# EAGLE schematic Panel (EAGLE 7.5.0)

## Sheet 1 of 4: MAIN
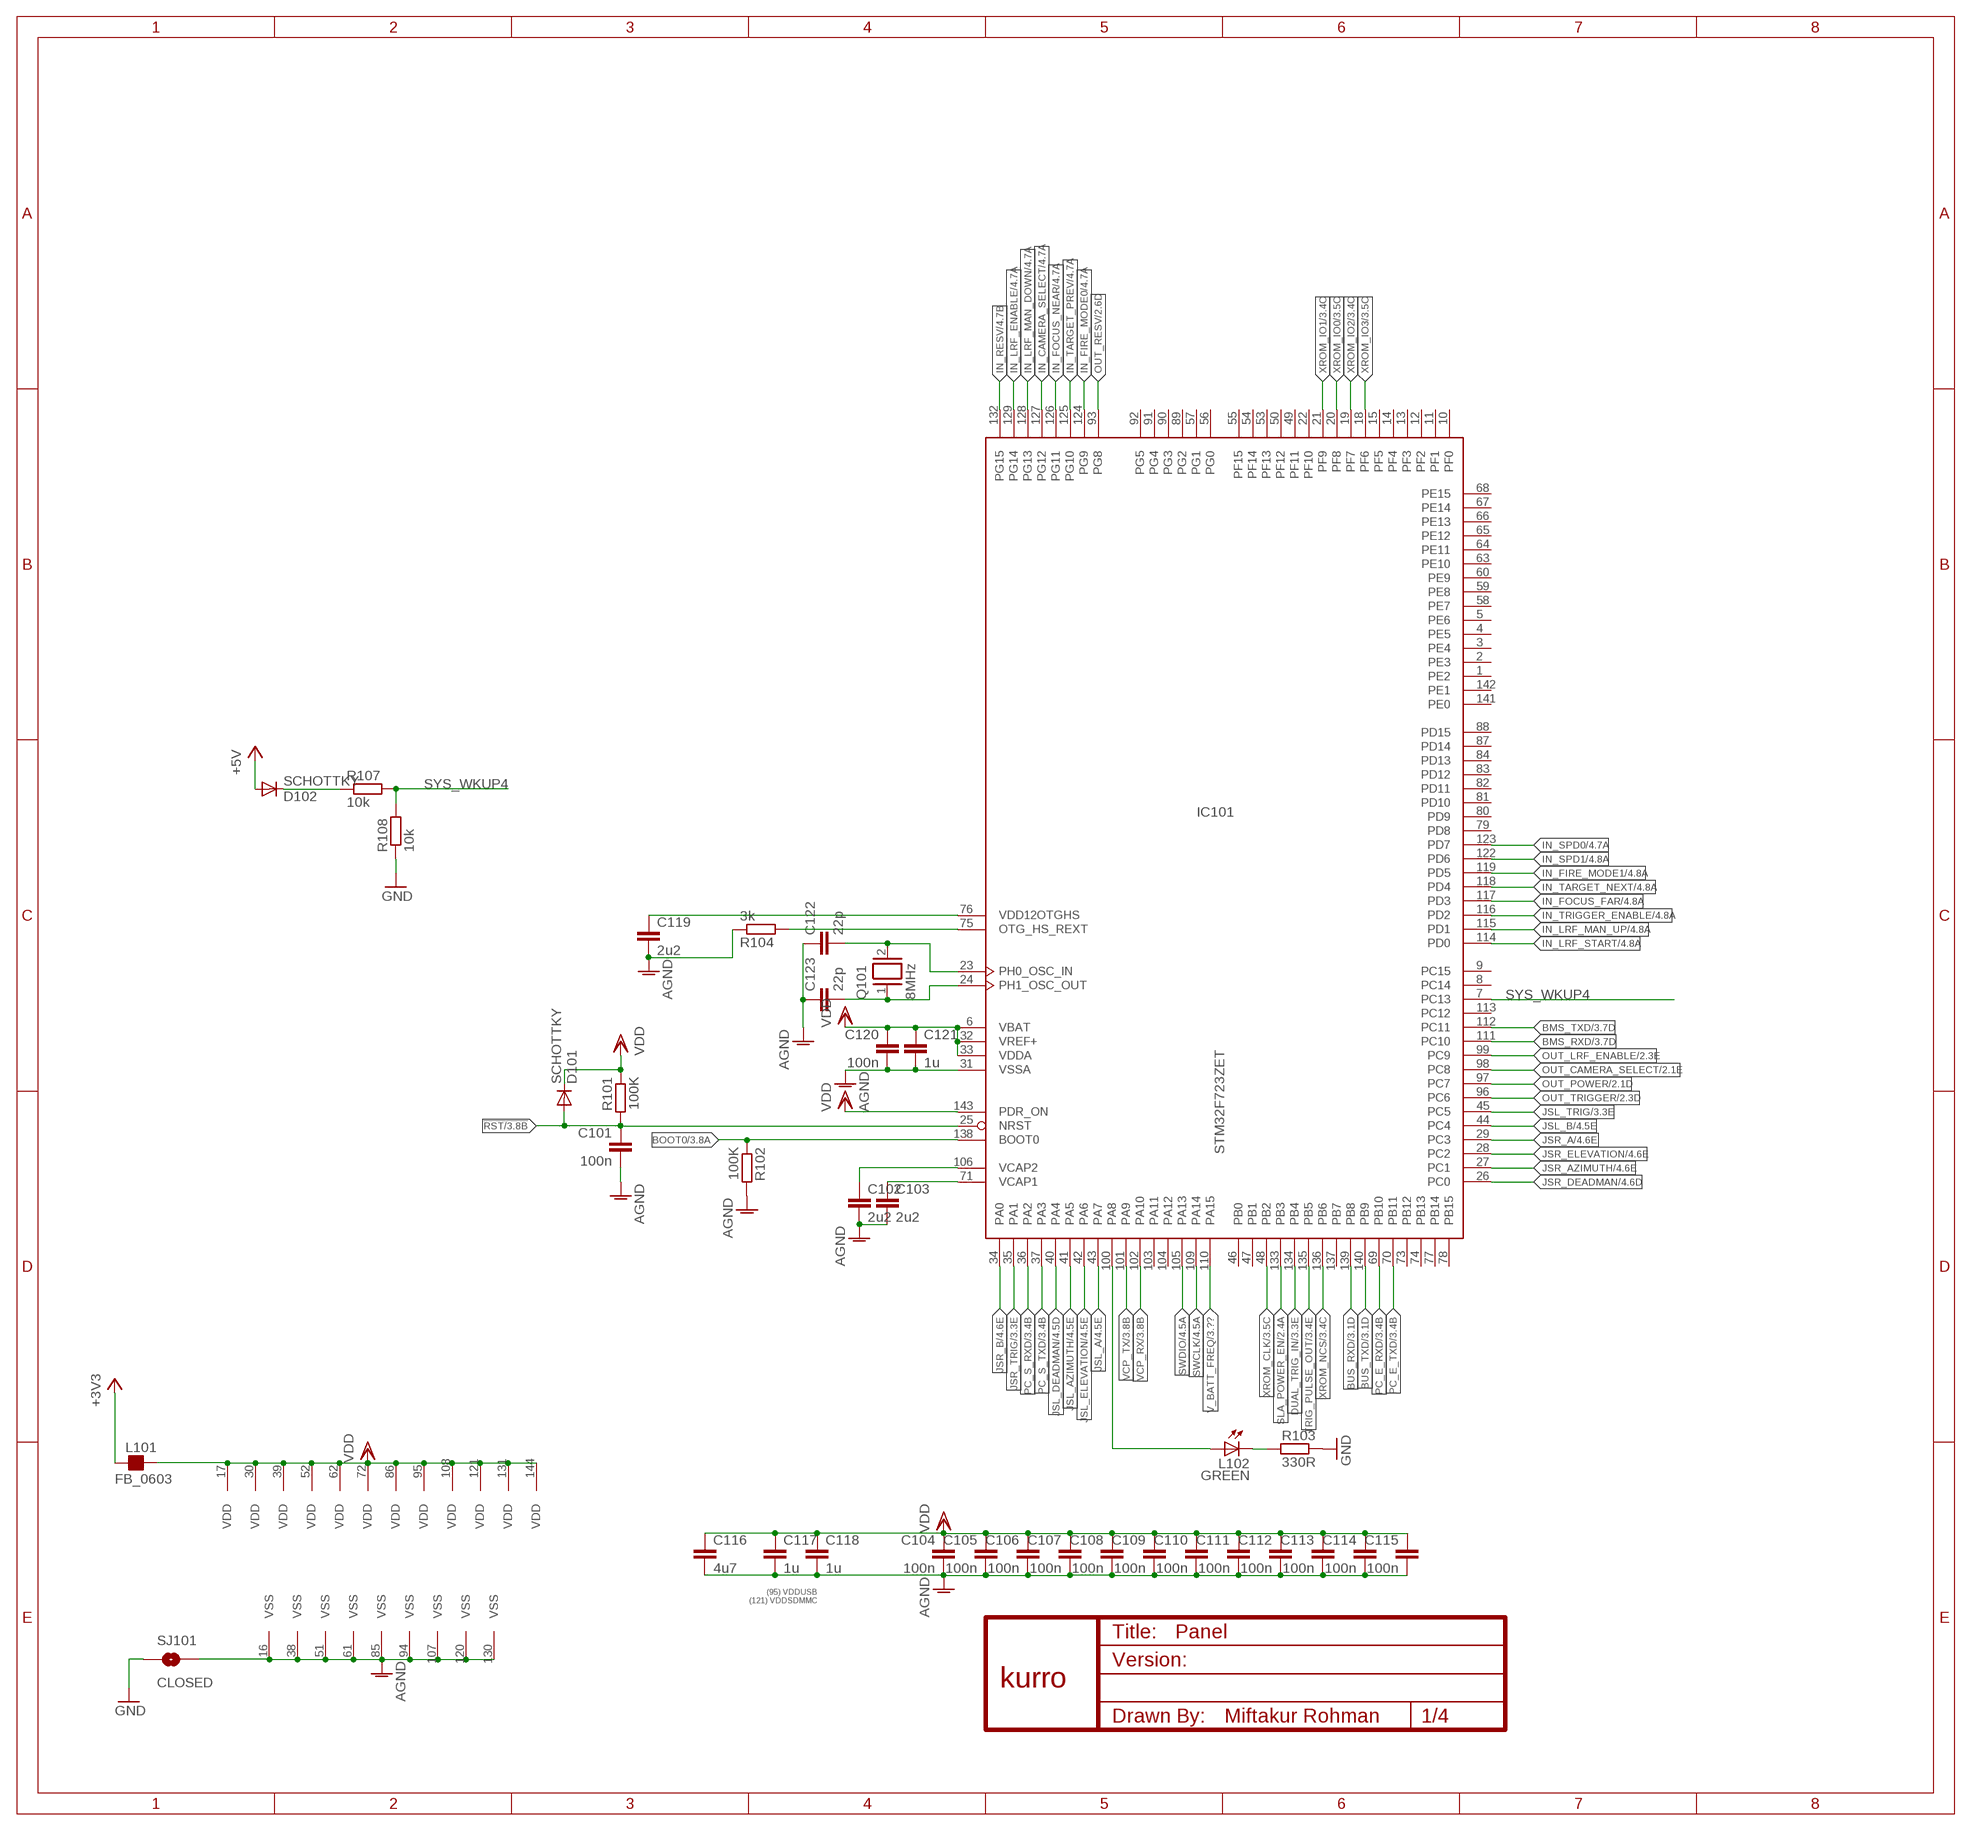
[diagram p0: schematic, sheet 1]

### Parts
C101  100n  C-EUC0603  [C0603]
C102  2u2  C-EUC0805  [C0805]
C103  2u2  C-EUC0805  [C0805]
C104  100n  C-EUC0603  [C0603]
C105  100n  C-EUC0603  [C0603]
C106  100n  C-EUC0603  [C0603]
C107  100n  C-EUC0603  [C0603]
C108  100n  C-EUC0603  [C0603]
C109  100n  C-EUC0603  [C0603]
C110  100n  C-EUC0603  [C0603]
C111  100n  C-EUC0603  [C0603]
C112  100n  C-EUC0603  [C0603]
C113  100n  C-EUC0603  [C0603]
C114  100n  C-EUC0603  [C0603]
C115  100n  C-EUC0603  [C0603]
C116  4u7  C-EUC0805  [C0805]
C117  1u  C-EUC0805  [C0805]
C118  1u  C-EUC0805  [C0805]
C119  2u2  C-EUC0805  [C0805]
C120  100n  C-EUC0603  [C0603]
C121  1u  C-EUC0805  [C0805]
C122  22p  C-EUC0603  [C0603]
C123  22p  C-EUC0603  [C0603]
D101  SCHOTTKY  DIODE-MICROMELF-W  [MICROMELF-W]
D102  SCHOTTKY  DIODE-MICROMELF-W  [MICROMELF-W]
IC101  STM32F723ZET  [LQFP144-2]
L101  FB_0603  [L0603]
L102  GREEN  LEDCHIP-LED0805  [CHIP-LED0805]
Q101  8MHz  XTAL/S  [QS]
R101  100K  R-EU_R0603  [R0603]
R102  100K  R-EU_R0603  [R0603]
R103  330R  R-EU_R0603  [R0603]
R104  3k  R-EU_R0603  [R0603]
R107  10k  R-EU_R0603  [R0603]
R108  10k  R-EU_R0603  [R0603]
SJ101  CLOSED  SOLDERJUMPERTRACE_THICK  [SJ_2S-TRACE_THICK]
U$2  KURRO_FOOTPRINT  [KURRO-LOGO]

### Nets
!RST [ic]: C101.1 D101.A IC101.25(NRST) R101.2 ; also sheet 3
+3V3: L101.1 ; also sheet 2,3,4
+5V: D102.A ; also sheet 2,3
AGND [ic]: C101.2 C102.2 C103.2 C104.2 C105.2 C106.2 C107.2 C108.2 C109.2 C110.2 C111.2 C112.2 C113.2 C114.2 C115.2 C116.2 C117.2 C118.2 C119.2 C120.2 C121.2 C122.1 C123.1 IC101.16(VSS) IC101.31(VSSA) IC101.38(VSS) IC101.51(VSS) IC101.61(VSS) IC101.85(VSS) IC101.94(VSS) IC101.107(VSS) IC101.120(VSS) IC101.130(VSS) R102.2 R104.1 SJ101.2
BMS_RXD: IC101.111(PC10) ; also sheet 3
BMS_TXD: IC101.112(PC11) ; also sheet 3
BOOT0 [ic]: IC101.138(BOOT0) R102.1 ; also sheet 3
BUS_RXD: IC101.139(PB8) ; also sheet 3
BUS_TXD: IC101.140(PB9) ; also sheet 3
DUAL_TRIG_IN: IC101.134(PB4) ; also sheet 3
GND: R103.1 R108.1 SJ101.1 ; also sheet 2,3,4
IN_CAMERA_SELECT: IC101.127(PG12) ; also sheet 4
IN_FIRE_MODE0: IC101.124(PG9) ; also sheet 4
IN_FIRE_MODE1: IC101.119(PD5) ; also sheet 4
IN_FOCUS_FAR: IC101.117(PD3) ; also sheet 4
IN_FOCUS_NEAR: IC101.126(PG11) ; also sheet 4
IN_LRF_ENABLE: IC101.129(PG14) ; also sheet 4
IN_LRF_MAN_DOWN: IC101.128(PG13) ; also sheet 4
IN_LRF_MAN_UP: IC101.115(PD1) ; also sheet 4
IN_LRF_START: IC101.114(PD0) ; also sheet 4
IN_RESV: IC101.132(PG15) ; also sheet 4
IN_SPD0: IC101.123(PD7) ; also sheet 4
IN_SPD1: IC101.122(PD6) ; also sheet 4
IN_TARGET_NEXT: IC101.118(PD4) ; also sheet 4
IN_TARGET_PREV: IC101.125(PG10) ; also sheet 4
IN_TRIGGER_ENABLE: IC101.116(PD2) ; also sheet 4
JSL_A [ic]: IC101.43(PA7) ; also sheet 4
JSL_AZIMUTH [ic]: IC101.41(PA5) ; also sheet 4
JSL_B [ic]: IC101.44(PC4) ; also sheet 4
JSL_DEADMAN [ic]: IC101.40(PA4) ; also sheet 4
JSL_ELEVATION [ic]: IC101.42(PA6) ; also sheet 4
JSL_TRIG [ic]: IC101.45(PC5) ; also sheet 3,4
JSR_A [ic]: IC101.29(PC3) ; also sheet 4
JSR_AZIMUTH [ic]: IC101.27(PC1) ; also sheet 4
JSR_B [ic]: IC101.34(PA0) ; also sheet 4
JSR_DEADMAN [ic]: IC101.26(PC0) ; also sheet 4
JSR_ELEVATION [ic]: IC101.28(PC2) ; also sheet 4
JSR_TRIG [ic]: IC101.35(PA1) ; also sheet 3,4
N$1: IC101.75(OTG_HS_REXT) R104.2
N$9: L102.C R103.2
N$12: IC101.100(PA8) L102.A
N$13: C119.1 IC101.76(VDD12OTGHS)
N$14 [ic]: C123.2 IC101.24(PH1_OSC_OUT) Q101.1
N$16 [ic]: C122.2 IC101.23(PH0_OSC_IN) Q101.2
N$34: D102.C R107.1
OUT_CAMERA_SELECT: IC101.98(PC8) ; also sheet 2
OUT_LRF_ENABLE: IC101.99(PC9) ; also sheet 2
OUT_POWER: IC101.97(PC7) ; also sheet 2
OUT_RESV: IC101.93(PG8) ; also sheet 2
OUT_TRIGGER: IC101.96(PC6) ; also sheet 2
PC_E_RXD [ic]: IC101.69(PB10) ; also sheet 3
PC_E_TXD [ic]: IC101.70(PB11) ; also sheet 3
PC_S_RXD: IC101.36(PA2) ; also sheet 3
PC_S_TXD: IC101.37(PA3) ; also sheet 3
SLA_POWER_EN [ic]: IC101.133(PB3) ; also sheet 2
SWCLK [ic]: IC101.109(PA14) ; also sheet 4
SWDIO [ic]: IC101.105(PA13) ; also sheet 4
SYS_WKUP4: IC101.7(PC13) R107.2 R108.2
TRIG_PULSE_OUT [ic]: IC101.135(PB5) ; also sheet 3
V_BATT_FREQ: IC101.110(PA15) ; also sheet 3
VCAP1: C103.1 IC101.71(VCAP1)
VCAP2: C102.1 IC101.106(VCAP2)
VCP_RX [ic]: IC101.102(PA10) ; also sheet 3,4
VCP_TX [ic]: IC101.101(PA9) ; also sheet 3,4
VDD [ic]: C104.1 C105.1 C106.1 C107.1 C108.1 C109.1 C110.1 C111.1 C112.1 C113.1 C114.1 C115.1 C116.1 C117.1 C118.1 C120.1 C121.1 D101.C IC101.6(VBAT) IC101.17(VDD) IC101.30(VDD) IC101.32(VREF+) IC101.33(VDDA) IC101.39(VDD) IC101.52(VDD) IC101.62(VDD) IC101.72(VDD) IC101.86(VDD) IC101.95(VDD) IC101.108(VDD) IC101.121(VDD) IC101.131(VDD) IC101.143(PDR_ON) IC101.144(VDD) L101.2 R101.1 ; also sheet 2,3,4
XROM_CLK [ic]: IC101.48(PB2) ; also sheet 3
XROM_IO0 [ic]: IC101.20(PF8) ; also sheet 3
XROM_IO1 [ic]: IC101.21(PF9) ; also sheet 3
XROM_IO2 [ic]: IC101.19(PF7) ; also sheet 3
XROM_IO3 [ic]: IC101.18(PF6) ; also sheet 3
XROM_NCS [ic]: IC101.136(PB6) ; also sheet 3
Unconnected: IC101.1(PE2) IC101.2(PE3) IC101.3(PE4) IC101.4(PE5) IC101.5(PE6) IC101.8(PC14) IC101.9(PC15) IC101.10(PF0) IC101.11(PF1) IC101.12(PF2) IC101.13(PF3) IC101.14(PF4) IC101.15(PF5) IC101.22(PF10) IC101.46(PB0) IC101.47(PB1) IC101.49(PF11) IC101.50(PF12) IC101.53(PF13) IC101.54(PF14) IC101.55(PF15) IC101.56(PG0) IC101.57(PG1) IC101.58(PE7) IC101.59(PE8) IC101.60(PE9) IC101.63(PE10) IC101.64(PE11) IC101.65(PE12) IC101.66(PE13) IC101.67(PE14) IC101.68(PE15) IC101.73(PB12) IC101.74(PB13) IC101.77(PB14) IC101.78(PB15) IC101.79(PD8) IC101.80(PD9) IC101.81(PD10) IC101.82(PD11) IC101.83(PD12) IC101.84(PD13) IC101.87(PD14) IC101.88(PD15) IC101.89(PG2) IC101.90(PG3) IC101.91(PG4) IC101.92(PG5) IC101.103(PA11) IC101.104(PA12) IC101.113(PC12) IC101.137(PB7) IC101.141(PE0) IC101.142(PE1)

### Notes on the sheet
- (95) VDDUSB
  (121) VDDSDMMC

## Sheet 2 of 4: PSU
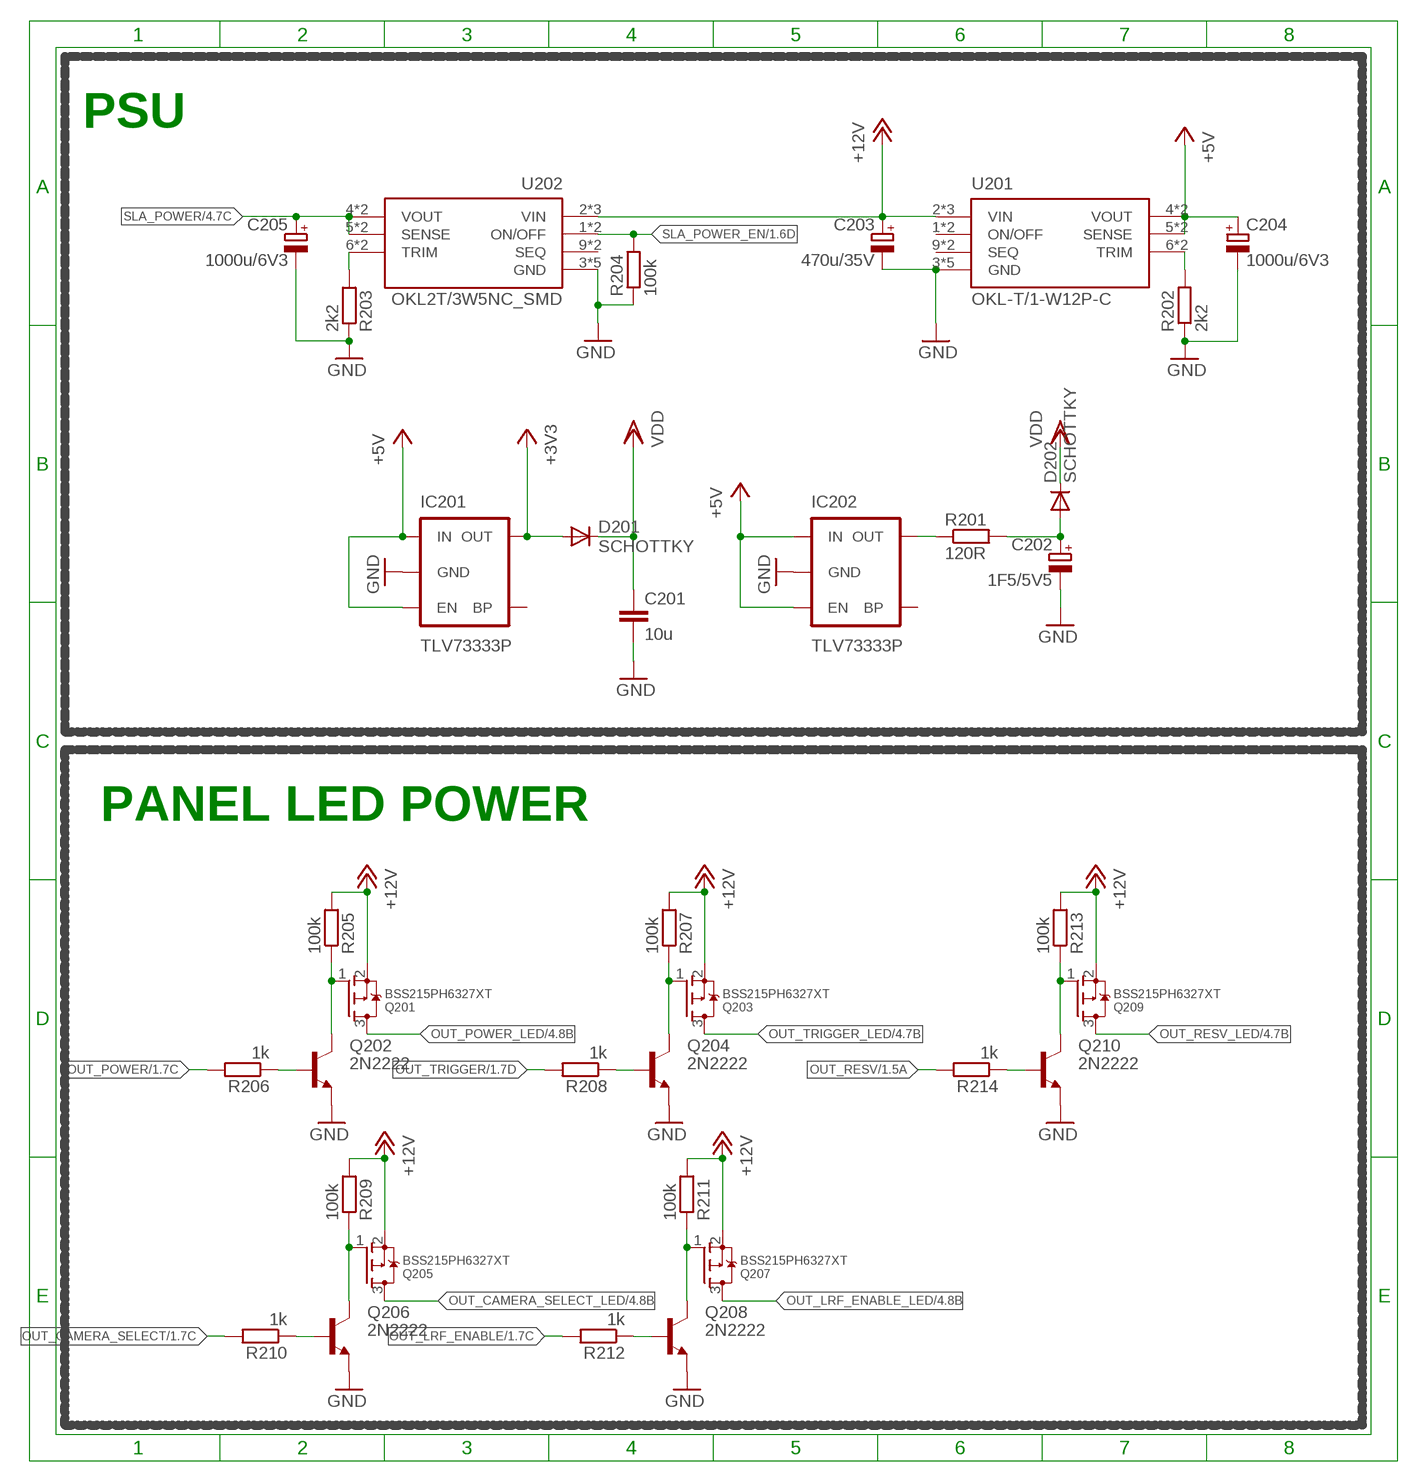
[diagram p1: schematic, sheet 2]

### Parts
C201  10u  C-EUC0805  [C0805]
C202  1F5/5V5  SUPER_CAP_1F/5V5  [SC_1F/5V5]
C203  470u/35V  CPOL-EU153CLV-1012  [153CLV-1012]
C204  1000u/6V3  CPOL-EU153CLV-0810  [153CLV-0810]
C205  1000u/6V3  CPOL-EU153CLV-0810  [153CLV-0810]
D201  SCHOTTKY  DIODE-MICROMELF-W  [MICROMELF-W]
D202  SCHOTTKY  DIODE-MICROMELF-W  [MICROMELF-W]
IC201  TLV73333P  V_REG_LDOSMD  [SOT23-5]
IC202  TLV73333P  V_REG_LDOSMD  [SOT23-5]
Q201  BSS215PH6327XT  A03401-WIDE  [SOT23-W]
Q202  2N2222  2N2222-REFLOW  [SOT23]
Q203  BSS215PH6327XT  A03401-WIDE  [SOT23-W]
Q204  2N2222  2N2222-REFLOW  [SOT23]
Q205  BSS215PH6327XT  A03401-WIDE  [SOT23-W]
Q206  2N2222  2N2222-REFLOW  [SOT23]
Q207  BSS215PH6327XT  A03401-WIDE  [SOT23-W]
Q208  2N2222  2N2222-REFLOW  [SOT23]
Q209  BSS215PH6327XT  A03401-WIDE  [SOT23-W]
Q210  2N2222  2N2222-REFLOW  [SOT23]
R201  120R  R-EU_R0603  [R0603]
R202  2k2  R-EU_R0603  [R0603]
R203  2k2  R-EU_R0603  [R0603]
R204  100k  R-EU_R0603  [R0603]
R205  100k  R-EU_R0603  [R0603]
R206  1k  R-EU_R0603  [R0603]
R207  100k  R-EU_R0603  [R0603]
R208  1k  R-EU_R0603  [R0603]
R209  100k  R-EU_R0603  [R0603]
R210  1k  R-EU_R0603  [R0603]
R211  100k  R-EU_R0603  [R0603]
R212  1k  R-EU_R0603  [R0603]
R213  100k  R-EU_R0603  [R0603]
R214  1k  R-EU_R0603  [R0603]
U201  OKL-T/1-W12P-C  OKL2T/3W5NC_SMD  [OKL2T/3W5NC]
U202  OKL2T/3W5NC_SMD  [OKL2T/3W5NC]

### Nets
+3V3: D201.A IC201.5(OUT) ; also sheet 1,3,4
+5V: C204.+ IC201.1(IN) IC201.3(EN) IC202.1(IN) IC202.3(EN) U201.4(VOUT) U201.4@1(VOUT) U201.5(SENSE) U201.5@1(SENSE) ; also sheet 1,3
+12V [power]: C203.+ Q201.2(S) Q203.2(S) Q205.2(S) Q207.2(S) Q209.2(S) R205.2 R207.2 R209.2 R211.2 R213.2 U201.2(VIN) U201.2@1(VIN) U201.2@2(VIN) U202.2(VIN) U202.2@1(VIN) U202.2@2(VIN) ; also sheet 3,4
GND: C201.2 C202.2(-) C203.- C204.- C205.- IC201.2(GND) IC202.2(GND) Q202.2(E) Q204.2(E) Q206.2(E) Q208.2(E) Q210.2(E) R202.1 R203.1 R204.1 U201.3(GND) U201.3@1(GND) U201.3@2(GND) U201.7(GND) U201.7@1(GND) U202.3(GND) U202.3@1(GND) U202.3@2(GND) U202.7(GND) U202.7@1(GND) ; also sheet 1,3,4
N$6: R202.2 U201.6(TRIM) U201.6@1(TRIM)
N$7: IC202.5(OUT) R201.1
N$17: Q209.1(G) Q210.3(C) R213.1
N$18: Q201.1(G) Q202.3(C) R205.1
N$20: Q202.1(B) R206.1
N$21: Q203.1(G) Q204.3(C) R207.1
N$32: Q204.1(B) R208.1
N$33: Q210.1(B) R214.1
N$48: Q205.1(G) Q206.3(C) R209.1
N$49: Q206.1(B) R210.1
N$51: Q207.1(G) Q208.3(C) R211.1
N$52: Q208.1(B) R212.1
N$53: R203.2 U202.6(TRIM) U202.6@1(TRIM)
OUT_CAMERA_SELECT: R210.2 ; also sheet 1
OUT_CAMERA_SELECT_LED: Q205.3(D) ; also sheet 4
OUT_LRF_ENABLE: R212.2 ; also sheet 1
OUT_LRF_ENABLE_LED: Q207.3(D) ; also sheet 4
OUT_POWER: R206.2 ; also sheet 1
OUT_POWER_LED: Q201.3(D) ; also sheet 4
OUT_RESV: R214.2 ; also sheet 1
OUT_RESV_LED: Q209.3(D) ; also sheet 4
OUT_TRIGGER: R208.2 ; also sheet 1
OUT_TRIGGER_LED: Q203.3(D) ; also sheet 4
SLA_POWER: C205.+ U202.4(VOUT) U202.4@1(VOUT) U202.5(SENSE) U202.5@1(SENSE) ; also sheet 4
SLA_POWER_EN [ic]: R204.2 U202.1(ON/OFF) U202.1@1(ON/OFF) ; also sheet 1
V_SCAP1: C202.1(+) D202.A R201.2
VDD [ic]: C201.1 D201.C D202.C ; also sheet 1,3,4
Unconnected: IC201.4(BP) IC202.4(BP) U201.1(ON/OFF) U201.1@1(ON/OFF) U201.9(SEQ) U201.9@1(SEQ) U202.9(SEQ) U202.9@1(SEQ)

### Notes on the sheet
- PSU
- PANEL LED POWER

## Sheet 3 of 4: I/F
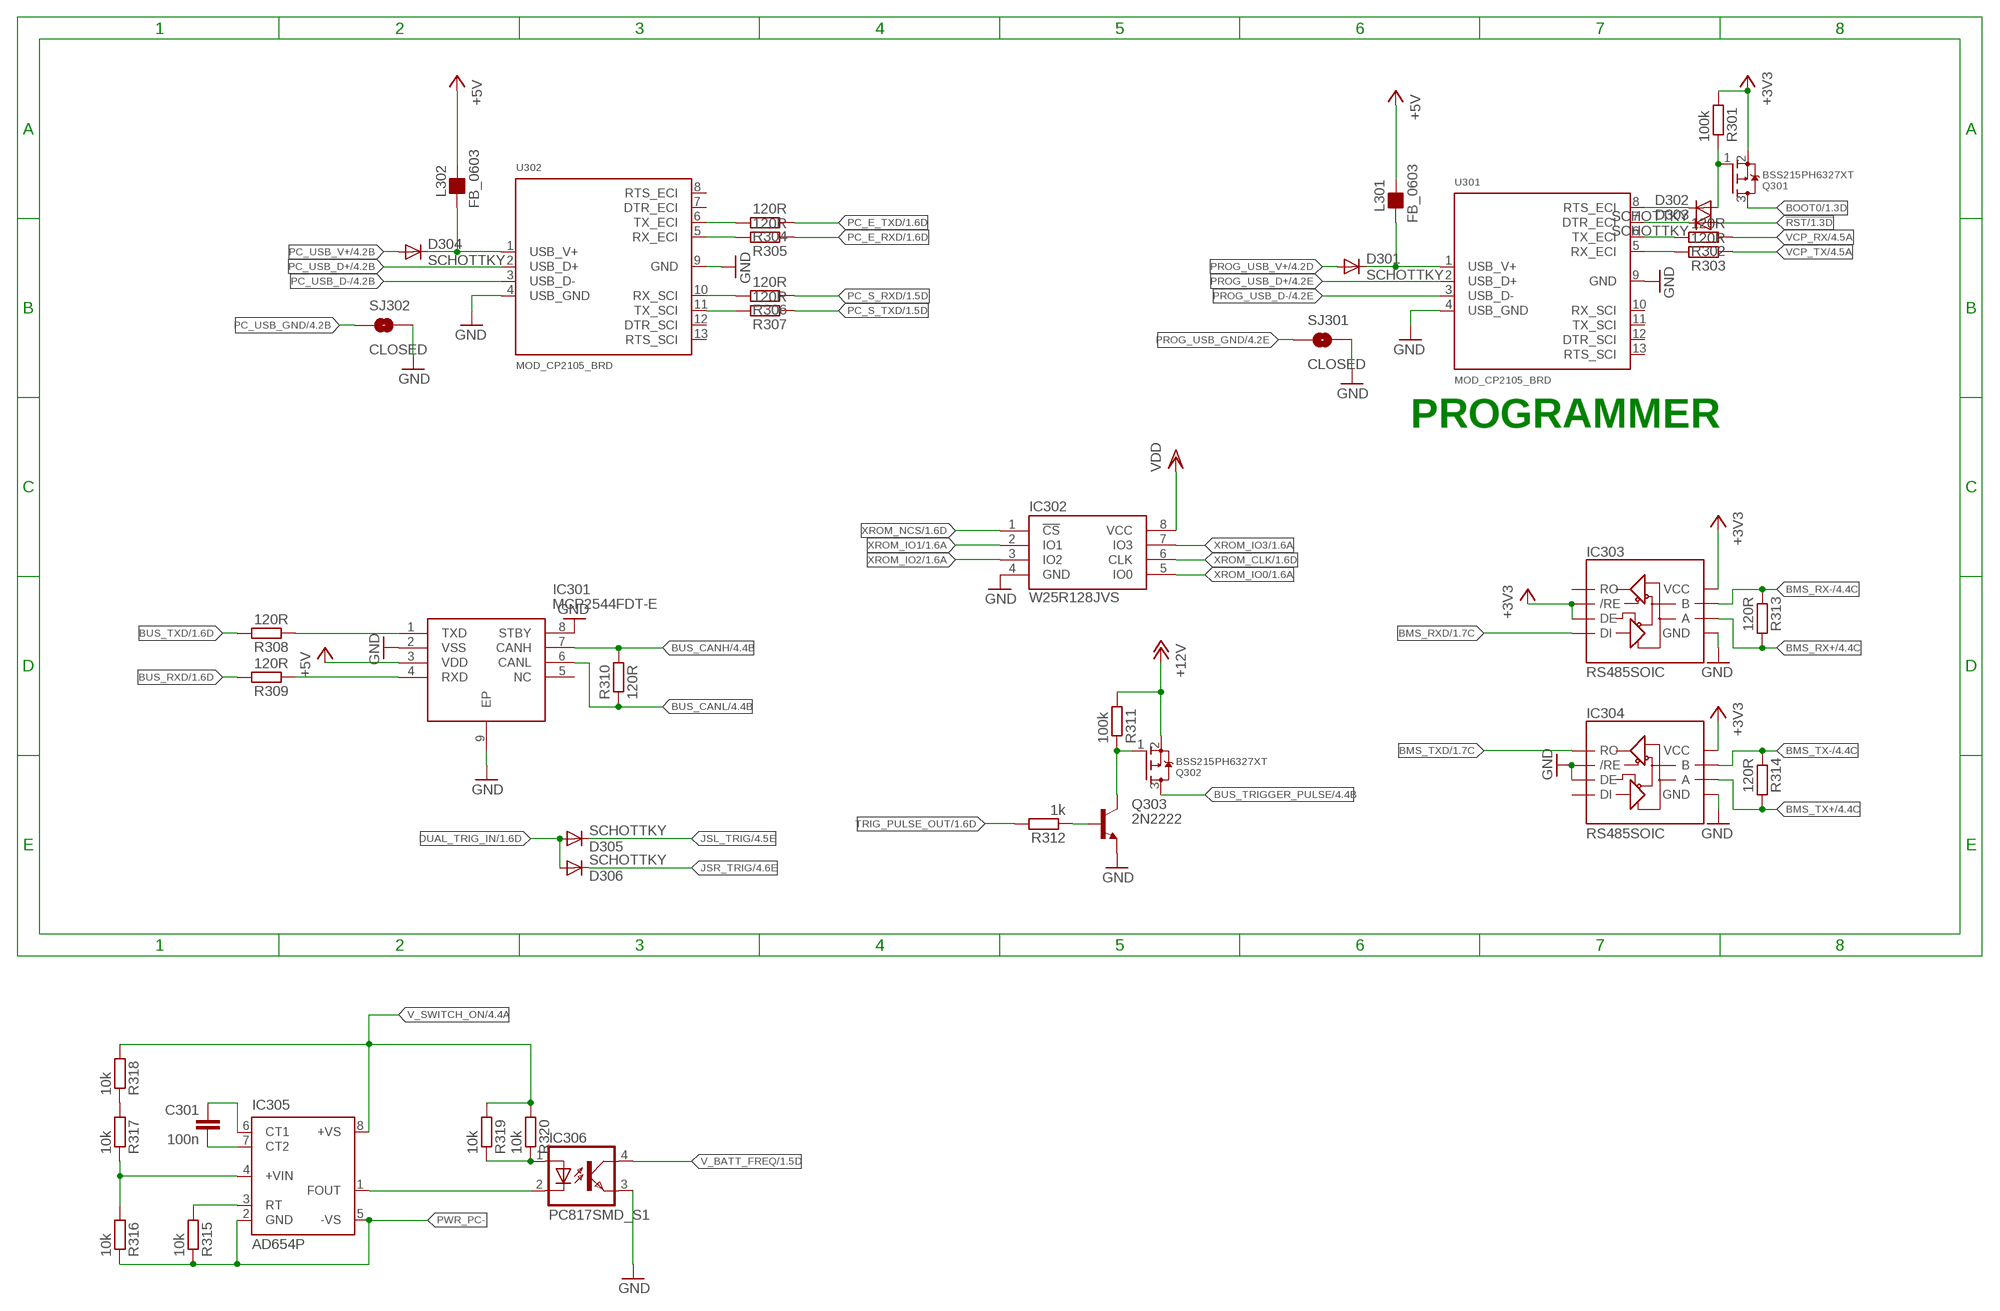
[diagram p2: schematic, sheet 3]

### Parts
C301  100n  C-EUC0603  [C0603]
D301  SCHOTTKY  DIODE-MICROMELF-W  [MICROMELF-W]
D302  SCHOTTKY  DIODE-MICROMELF-W  [MICROMELF-W]
D303  SCHOTTKY  DIODE-MICROMELF-W  [MICROMELF-W]
D304  SCHOTTKY  DIODE-MICROMELF-W  [MICROMELF-W]
D305  SCHOTTKY  DIODE-MICROMELF-W  [MICROMELF-W]
D306  SCHOTTKY  DIODE-MICROMELF-W  [MICROMELF-W]
IC301  MCP2544FDT-E  [TDFN-8]
IC302  W25R128JVS  [SO08]
IC303  RS485SOIC  [SO08]
IC304  RS485SOIC  [SO08]
IC305  AD654P  [DIL08]
IC306  PC817SMD_S1  [PC817SMD]
L301  FB_0603  [L0603]
L302  FB_0603  [L0603]
Q301  BSS215PH6327XT  A03401-WIDE  [SOT23-W]
Q302  BSS215PH6327XT  A03401-WIDE  [SOT23-W]
Q303  2N2222  2N2222-REFLOW  [SOT23]
R301  100k  R-EU_R0603  [R0603]
R302  120R  R-EU_R0603  [R0603]
R303  120R  R-EU_R0603  [R0603]
R304  120R  R-EU_R0603  [R0603]
R305  120R  R-EU_R0603  [R0603]
R306  120R  R-EU_R0603  [R0603]
R307  120R  R-EU_R0603  [R0603]
R308  120R  R-EU_R0603  [R0603]
R309  120R  R-EU_R0603  [R0603]
R310  120R  R-EU_R0603  [R0603]
R311  100k  R-EU_R0603  [R0603]
R312  1k  R-EU_R0603  [R0603]
R313  120R  R-EU_R0603  [R0603]
R314  120R  R-EU_R0603  [R0603]
R315  10k  R-EU_R0603  [R0603]
R316  10k  R-EU_R0603  [R0603]
R317  10k  R-EU_R0603  [R0603]
R318  10k  R-EU_R0603  [R0603]
R319  10k  R-EU_R0603  [R0603]
R320  10k  R-EU_R0603  [R0603]
SJ301  CLOSED  SOLDERJUMPERTRACE_THICK  [SJ_2S-TRACE_THICK]
SJ302  CLOSED  SOLDERJUMPERTRACE_THICK  [SJ_2S-TRACE_THICK]
U301  MOD_CP2105_BRD  [MOD_CP2105_BOARD]
U302  MOD_CP2105_BRD  [MOD_CP2105_BOARD]

### Nets
!RST [ic]: D303.A ; also sheet 1
+3V3: IC303.2(/RE) IC303.3(DE) IC303.8(VCC) IC304.8(VCC) Q301.2(S) R301.2 ; also sheet 1,2,4
+5V: IC301.3(VDD) L301.2 L302.2 ; also sheet 1,2
+12V [power]: Q302.2(S) R311.2 ; also sheet 2,4
BMS_RX+: IC303.6(A) R313.2 ; also sheet 4
BMS_RX-: IC303.7(B) R313.1 ; also sheet 4
BMS_RXD: IC303.4(DI) ; also sheet 1
BMS_TX+: IC304.6(A) R314.2 ; also sheet 4
BMS_TX-: IC304.7(B) R314.1 ; also sheet 4
BMS_TXD: IC304.1(RO) ; also sheet 1
BOOT0 [ic]: Q301.3(D) ; also sheet 1
BUS_CANH: IC301.7(CANH) R310.2 ; also sheet 4
BUS_CANL: IC301.6(CANL) R310.1 ; also sheet 4
BUS_RXD: R309.2 ; also sheet 1
BUS_TRIGGER_PULSE: Q302.3(D) ; also sheet 4
BUS_TXD: R308.2 ; also sheet 1
DUAL_TRIG_IN: D305.A D306.A ; also sheet 1
GND: IC301.2(VSS) IC301.8(STBY) IC301.9(EP) IC302.4(GND) IC303.5(GND) IC304.2(/RE) IC304.3(DE) IC304.5(GND) IC306.3(EMIT) Q303.2(E) SJ301.2 SJ302.2 U301.4(USB_GND) U301.9(GND) U302.4(USB_GND) U302.9(GND) ; also sheet 1,2,4
JSL_TRIG [ic]: D305.C ; also sheet 1,4
JSR_TRIG [ic]: D306.C ; also sheet 1,4
N$2: Q302.1(G) Q303.3(C) R311.1
N$3: Q303.1(B) R312.1
N$4: IC301.1(TXD) R308.1
N$5: IC301.4(RXD) R309.1
N$8: R303.2 U301.5(RX_ECI)
N$15: IC305.1(FOUT) IC306.2(C)
N$19: R302.2 U301.6(TX_ECI)
N$22: D303.C U301.7(DTR_ECI)
N$23: D302.C U301.8(RTS_ECI)
N$24: D301.C L301.1 U301.1(USB_V+)
N$25: D302.A Q301.1(G) R301.1
N$26: R305.2 U302.5(RX_ECI)
N$27: R304.2 U302.6(TX_ECI)
N$28: R306.2 U302.10(RX_SCI)
N$29: R307.2 U302.11(TX_SCI)
N$30: IC306.1(A) R319.1 R320.1
N$31: D304.C L302.1 U302.1(USB_V+)
N$35: IC305.3(RT) R315.2
N$37: C301.2 IC305.7(CT2)
N$38: C301.1 IC305.6(CT1)
N$39: IC305.4(+VIN) R316.2 R317.1
N$41: R317.2 R318.1
PC_E_RXD [ic]: R305.1 ; also sheet 1
PC_E_TXD [ic]: R304.1 ; also sheet 1
PC_S_RXD: R306.1 ; also sheet 1
PC_S_TXD: R307.1 ; also sheet 1
PC_USB_D+: U302.2(USB_D+) ; also sheet 4
PC_USB_D-: U302.3(USB_D-) ; also sheet 4
PC_USB_GND: SJ302.1 ; also sheet 4
PC_USB_V+: D304.A ; also sheet 4
PROG_USB_D+: U301.2(USB_D+) ; also sheet 4
PROG_USB_D-: U301.3(USB_D-) ; also sheet 4
PROG_USB_GND: SJ301.1 ; also sheet 4
PROG_USB_V+: D301.A ; also sheet 4
PWR_PC- [power]: IC305.2(GND) IC305.5(-VS) R315.1 R316.1 ; also sheet 4
TRIG_PULSE_OUT [ic]: R312.2 ; also sheet 1
V_BATT_FREQ: IC306.4(COL) ; also sheet 1
V_SWITCH_ON [power]: IC305.8(+VS) R318.2 R319.2 R320.2 ; also sheet 4
VCP_RX [ic]: R302.1 ; also sheet 1,4
VCP_TX [ic]: R303.1 ; also sheet 1,4
VDD [ic]: IC302.8(VCC) ; also sheet 1,2,4
XROM_CLK [ic]: IC302.6(CLK) ; also sheet 1
XROM_IO0 [ic]: IC302.5(IO0) ; also sheet 1
XROM_IO1 [ic]: IC302.2(IO1) ; also sheet 1
XROM_IO2 [ic]: IC302.3(IO2) ; also sheet 1
XROM_IO3 [ic]: IC302.7(IO3) ; also sheet 1
XROM_NCS [ic]: IC302.1(!CS) ; also sheet 1
Unconnected: IC301.5(NC) IC303.1(RO) IC304.4(DI) U301.10(RX_SCI) U301.11(TX_SCI) U301.12(DTR_SCI) U301.13(RTS_SCI) U302.7(DTR_ECI) U302.8(RTS_ECI) U302.12(DTR_SCI) U302.13(RTS_SCI)

### Notes on the sheet
- PROGRAMMER

## Sheet 4 of 4: CONNECTOR
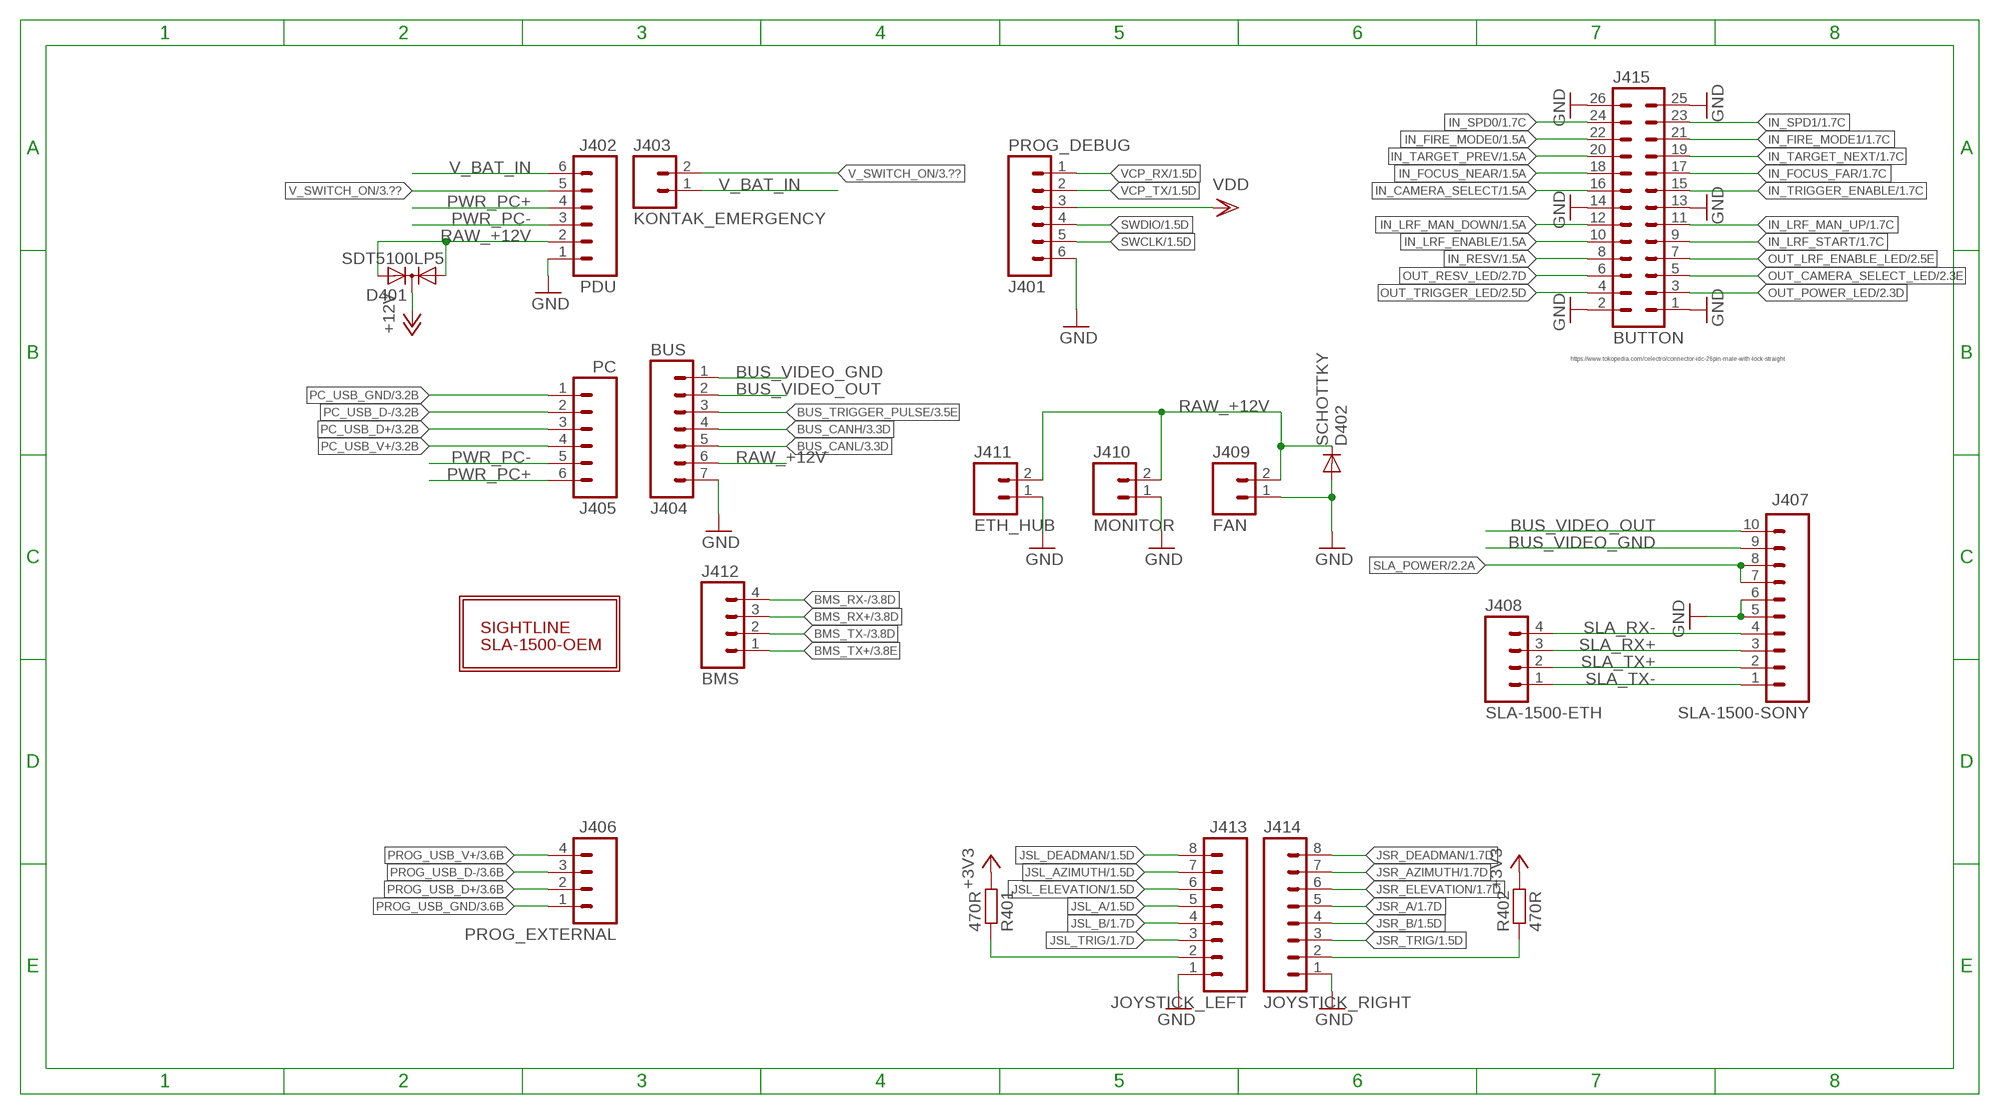
[diagram p3: schematic, sheet 4]

### Parts
D401  SDT5100LP5  [POWERDI5-3]
D402  SCHOTTKY  DIODE-MICROMELF-W  [MICROMELF-W]
J401  PROG_DEBUG  M06-XHS-VERT-SMD  [XHS-6-VERT-SMD]
J402  PDU  M06-XHS-RA  [XHS-6-RA]
J403  KONTAK_EMERGENCY  M02-XHS-RA  [XHS-2-RA]
J404  BUS  M07-XHS-RA  [XHS-7-RA]
J405  PC  M06-XHS-RA  [XHS-6-RA]
J406  PROG_EXTERNAL  M04-XHS-RA  [XHS-4-RA]
J407  SLA-1500-SONY  M10-XHS-VERT  [XHS-10-VERT]
J408  SLA-1500-ETH  M04-XHS-RA  [XHS-4-RA]
J409  FAN  M02-XHS-VERT  [XHS-2-VERT]
J410  MONITOR  M02-XHS-RA  [XHS-2-RA]
J411  ETH_HUB  M02-XHS-VERT  [XHS-2-VERT]
J412  BMS  M04-XHS-RA  [XHS-4-RA]
J413  JOYSTICK_LEFT  M08-XHS-RA  [XHS-8-RA]
J414  JOYSTICK_RIGHT  M08-XHS-RA  [XHS-8-RA]
J415  BUTTON  26V  [26V]
R401  470R  R-EU_R0603  [R0603]
R402  470R  R-EU_R0603  [R0603]
U401  SLA-1500-OEM  [SLA-1500-OEM]
U402  SLA-1500-OEM-RESTRICT  [SLA_1500-OEM-RESTRICT]

### Nets
+3V3: R401.2 R402.2 ; also sheet 1,2,3
+12V [power]: D401.3 ; also sheet 2,3
BMS_RX+: J412.3 ; also sheet 3
BMS_RX-: J412.4 ; also sheet 3
BMS_TX+: J412.1 ; also sheet 3
BMS_TX-: J412.2 ; also sheet 3
BUS_CANH: J404.4 ; also sheet 3
BUS_CANL: J404.5 ; also sheet 3
BUS_TRIGGER_PULSE: J404.3 ; also sheet 3
BUS_VIDEO_GND [ic]: J404.1 J407.9
BUS_VIDEO_OUT [ic]: J404.2 J407.10
GND: D402.A J401.6 J402.1 J404.7 J407.5 J407.6 J409.1 J410.1 J411.1 J413.1 J414.1 J415.1 J415.2 J415.13 J415.14 J415.25 J415.26 ; also sheet 1,2,3
IN_CAMERA_SELECT: J415.16 ; also sheet 1
IN_FIRE_MODE0: J415.22 ; also sheet 1
IN_FIRE_MODE1: J415.21 ; also sheet 1
IN_FOCUS_FAR: J415.17 ; also sheet 1
IN_FOCUS_NEAR: J415.18 ; also sheet 1
IN_LRF_ENABLE: J415.10 ; also sheet 1
IN_LRF_MAN_DOWN: J415.12 ; also sheet 1
IN_LRF_MAN_UP: J415.11 ; also sheet 1
IN_LRF_START: J415.9 ; also sheet 1
IN_RESV: J415.8 ; also sheet 1
IN_SPD0: J415.24 ; also sheet 1
IN_SPD1: J415.23 ; also sheet 1
IN_TARGET_NEXT: J415.19 ; also sheet 1
IN_TARGET_PREV: J415.20 ; also sheet 1
IN_TRIGGER_ENABLE: J415.15 ; also sheet 1
JSL_A [ic]: J413.5 ; also sheet 1
JSL_AZIMUTH [ic]: J413.7 ; also sheet 1
JSL_B [ic]: J413.4 ; also sheet 1
JSL_DEADMAN [ic]: J413.8 ; also sheet 1
JSL_ELEVATION [ic]: J413.6 ; also sheet 1
JSL_TRIG [ic]: J413.3 ; also sheet 1,3
JSR_A [ic]: J414.5 ; also sheet 1
JSR_AZIMUTH [ic]: J414.7 ; also sheet 1
JSR_B [ic]: J414.4 ; also sheet 1
JSR_DEADMAN [ic]: J414.8 ; also sheet 1
JSR_ELEVATION [ic]: J414.6 ; also sheet 1
JSR_TRIG [ic]: J414.3 ; also sheet 1,3
N$10: J414.2 R402.1
N$11: J413.2 R401.1
OUT_CAMERA_SELECT_LED: J415.5 ; also sheet 2
OUT_LRF_ENABLE_LED: J415.7 ; also sheet 2
OUT_POWER_LED: J415.3 ; also sheet 2
OUT_RESV_LED: J415.6 ; also sheet 2
OUT_TRIGGER_LED: J415.4 ; also sheet 2
PC_USB_D+: J405.3 ; also sheet 3
PC_USB_D-: J405.2 ; also sheet 3
PC_USB_GND: J405.1 ; also sheet 3
PC_USB_V+: J405.4 ; also sheet 3
PROG_USB_D+: J406.2 ; also sheet 3
PROG_USB_D-: J406.3 ; also sheet 3
PROG_USB_GND: J406.1 ; also sheet 3
PROG_USB_V+: J406.4 ; also sheet 3
PWR_PC+ [power]: J402.4 J405.6
PWR_PC- [power]: J402.3 J405.5 ; also sheet 3
RAW_+12V [power]: D401.1 D401.2 D402.C J402.2 J404.6 J409.2 J410.2 J411.2
SLA_POWER: J407.7 J407.8 ; also sheet 2
SLA_RX+: J407.3 J408.3
SLA_RX-: J407.4 J408.4
SLA_TX+: J407.2 J408.2
SLA_TX-: J407.1 J408.1
SWCLK [ic]: J401.5 ; also sheet 1
SWDIO [ic]: J401.4 ; also sheet 1
V_BAT_IN [power]: J402.6 J403.1
V_SWITCH_ON [power]: J402.5 J403.2 ; also sheet 3
VCP_RX [ic]: J401.1 ; also sheet 1,3
VCP_TX [ic]: J401.2 ; also sheet 1,3
VDD [ic]: J401.3 ; also sheet 1,2,3

### Notes on the sheet
- https://www.tokopedia.com/celectro/connector-idc-26pin-male-with-lock-straight

## Library data of the parts
C101 C104-C115 C120 C301 = resistor:C-EU: CAPACITOR, European symbol
C102 C103 C116-C119 C121-C123 C201 = rcl:C-EU: CAPACITOR, European symbol
C202 = rcws:SUPER_CAP
C203-C205 = resistor:CPOL-EU: POLARIZED CAPACITOR, European symbol
D101 D102 D201 D202 D301-D306 D402 = diode:DIODE-: DIODE
D401 = rcws:SDT5100LP5
IC101 = micro-stm_v3.1:STM32F723Z*T: ARM 32-bit Cortex™-M7 CPU 216 MHz maximum frequency 256 to 512 Kbytes of Flash memory 256 kbytes of SRAM 122 GPIOs 1.7 to 3.6 V application supply
IC201 IC202 = pixhawk2:V_REG_LDO: Voltage Regulator LDO Standard 150mA LDO voltage regulator in SOT-23 layout. Micrel part MIC5205. BP (by-pass) pin is used to lower output noise with 470pF cap.
IC301 = rcws:MCP2544FDT-E
IC302 = SparkFun-DigitalIC:W25R
IC303 IC304 = SparkFun-DigitalIC:RS485: RS485 transceiver
IC305 = analog-devices:AD654: Low Cost Monolithic Voltage-to-Frequency Converter
IC306 = rcws:PC817
J401 J402 J405 = SparkFun-Connectors:M06: Header 6 Standard 6-pin 0.1" header. Use with straight break away headers (SKU : PRT-00116), right angle break away headers (PRT-00553), swiss pins (PRT-00743), machine pins (PRT-00117), and female headers (PRT-00115). Molex polarized connector foot print use with SKU : PRT-08094 with associated crimp pins and housings. NOTES ON THE VARIANTS LOCK and LOCK_LONGPADS... This footprint was designed to help hold the alignment of a through-hole component (i.e. 6-pin header) while soldering it into place. You may notice that each hole has been shifted either up or down by 0.005 of an inch from it's more standard position (which is a perfectly straight line). This slight alteration caused the pins (the squares in the middle) to touch the edges of the holes. Because they are alternating, it causes a "brace" to hold the component in place. 0.005 has proven to be the perfect amount of "off-center" position when using our standard breakaway headers. Although looks a little odd when you look at the bare footprint, once you have a header in there, the alteration is very hard to notice. Also,if you push a header all the way into place, it is covered up entirely on the bottom side. This idea of altering the position of holes to aid alignment will be further integrated into the Sparkfun Library for other footprints. It can help hold any component with 3 or more connection pins.
J403 J409-J411 = SparkFun-Connectors:M02: Standard 2-pin 0.1" header. Use with - straight break away headers ( PRT-00116) - right angle break away headers (PRT-00553) - swiss pins (PRT-00743) - machine pins (PRT-00117) - female headers (PRT-00115) Molex polarized connector foot print use with: PRT-08233 with associated crimp pins and housings. 2.54_SCREWTERM for use with PRT-10571. 3.5mm Screw Terminal footprints for PRT-08084 5mm Screw Terminal footprints for use with PRT-08433
J404 = SparkFun-Connectors:M07: Header 7 Standard 7-pin 0.1" header. Use with straight break away headers (SKU : PRT-00116), right angle break away headers (PRT-00553), swiss pins (PRT-00743), machine pins (PRT-00117), and female headers (PRT-00115). NOTES ON THE VARIANTS LOCK and LOCK_LONGPADS... This footprint was designed to help hold the alignment of a through-hole component (i.e. 7-pin header) while soldering it into place. You may notice that each hole has been shifted either up or down by 0.005 of an inch from it's more standard position (which is usually a perfectly straight line). This slight alteration caused the pins (the squares in the middle) to touch the edges of the holes. Because they are alternating, it causes a "brace" to hold the header in place. 0.005 has proven to be the perfect amount of "off-center" position when using our standard breakaway headers. Although looks a little odd when you look at the bare footprint, once you have a header in there, the alteration is very hard to notice. Also, if you push a header all the way into place, it is covered up entirely on the bottom side. This idea of altering the position of holes to aid alignment will be further integrated into the Sparkfun Library for other footprints. It can help hold any component with 3 or more connection pins.
J406 J408 J412 = SparkFun-Connectors:M04: Header 4 Standard 4-pin 0.1" header. Use with straight break away headers (SKU : PRT-00116), right angle break away headers (PRT-00553), swiss pins (PRT-00743), machine pins (PRT-00117), and female headers (PRT-00115). Molex polarized connector foot print use with SKU : PRT-08231 with associated crimp pins and housings. 1MM SMD Version SKU: PRT-10208
J407 = SparkFun-Connectors:M10: Header 10 Standard 10-pin 0.1" header. Use with straight break away headers (SKU : PRT-00116), right angle break away headers (PRT-00553), swiss pins (PRT-00743), machine pins (PRT-00117), and female headers (PRT-00115).
J413 J414 = SparkFun-Connectors:M08: Header 8 Standard 8-pin 0.1" header. Use with straight break away headers (SKU : PRT-00116), right angle break away headers (PRT-00553), swiss pins (PRT-00743), machine pins (PRT-00117), and female headers (PRT-00115).
J415 = con-harting-v:26V: CONNECTOR
L101 L301 L302 = rc-master:FB_: FERRITE BEAD
L102 = led:LED: LED OSRAM: - CHIPLED LG R971, LG N971, LY N971, LG Q971, LY Q971, LO R971, LY R971 LH N974, LH R974 LS Q976, LO Q976, LY Q976 LO Q996 - Hyper CHIPLED LW Q18S LB Q993, LB Q99A, LB R99A - SideLED LS A670, LO A670, LY A670, LG A670, LP A670 LB A673, LV A673, LT A673, LW A673 LH A674 LY A675 LS A676, LA A676, LO A676, LY A676, LW A676 LS A679, LY A679, LG A679 - Hyper Micro SIDELED® LS Y876, LA Y876, LO Y876, LY Y876 LT Y87S - SmartLED LW L88C, LW L88S LB L89C, LB L89S, LG L890 LS L89K, LO L89K, LY L89K LS L896, LA L896, LO L896, LY L896 - TOPLED LS T670, LO T670, LY T670, LG T670, LP T670 LSG T670, LSP T670, LSY T670, LOP T670, LYG T670 LG T671, LOG T671, LSG T671 LB T673, LV T673, LT T673, LW T673 LH T674 LS T676, LA T676, LO T676, LY T676, LB T676, LH T676, LSB T676, LW T676 LB T67C, LV T67C, LT T67C, LS T67K, LO T67K, LY T67K, LW E67C LS E67B, LA E67B, LO E67B, LY E67B, LB E67C, LV E67C, LT E67C LW T67C LS T679, LY T679, LG T679 LS T770, LO T770, LY T770, LG T770, LP T770 LB T773, LV T773, LT T773, LW T773 LH T774 LS E675, LA E675, LY E675, LS T675 LS T776, LA T776, LO T776, LY T776, LB T776 LHGB T686 LT T68C, LB T68C - Hyper Mini TOPLED® LB M676 - Mini TOPLED Santana® LG M470 LS M47K, LO M47K, LY M47K Source: http://www.osram.convergy.de LUXEON: - LUMILED® LXK2-PW12-R00, LXK2-PW12-S00, LXK2-PW14-U00, LXK2-PW14-V00 LXK2-PM12-R00, LXK2-PM12-S00, LXK2-PM14-U00 LXK2-PE12-Q00, LXK2-PE12-R00, LXK2-PE12-S00, LXK2-PE14-T00, LXK2-PE14-U00 LXK2-PB12-K00, LXK2-PB12-L00, LXK2-PB12-M00, LXK2-PB14-N00, LXK2-PB14-P00, LXK2-PB14-Q00 LXK2-PR12-L00, LXK2-PR12-M00, LXK2-PR14-Q00, LXK2-PR14-R00 LXK2-PD12-Q00, LXK2-PD12-R00, LXK2-PD12-S00 LXK2-PH12-R00, LXK2-PH12-S00 LXK2-PL12-P00, LXK2-PL12-Q00, LXK2-PL12-R00 Source: www.luxeon.com KINGBRIGHT: KA-3528ASYC Source: www.kingbright.com
Q101 = special:XTAL/S: CRYSTAL
Q201 Q203 Q205 Q207 Q209 Q301 Q302 = rcws:A03401*: 30V P-Channel MOSFET Feature: VDS: -30V ID (at VGS=10V): -4A RDS(ON) (at VGS=10V): <50mOhm RDS(ON) (at VGS = 4.5V): <60mOhm RDS(ON) (at VGS = 2.5V): <85mOhm datasheet <http://www.aosmd.com/pdfs/datasheet/AO3401.pdf> tokopedia <https://www.tokopedia.com/tokopuwei/mosfet-ao3401-fet-ao3401-sot23-p-channel-30v-4a-a19t-sot-23-az37>
Q202 Q204 Q206 Q208 Q210 Q303 = scorpion:2N2222*
R101-R104 R107 R108 R204 R205 R207 R209 R211 R213 R301-R307 R311 R313-R320 = resistor:R-EU_: RESISTOR, European symbol
R201-R203 R206 R208 R210 R212 R214 R308-R310 R312 R401 R402 = rcl:R-EU_: RESISTOR, European symbol
SJ101 SJ301 SJ302 = SparkFun:SOLDERJUMPER: Solder Jumper Standard SMD solder jumper. Used to automate production. Two varients : Normally Open and Normally Closed are the same, but have different paste layers. NC will have a large amount of paste and should jumper during reflow.
U201 U202 = encPhone:OKL2T/3W5NC
U301 U302 = rcws:MOD_CP2105
U401 = rcws:SLA-1500-OEM
U402 = rcws:SLA-1500-OEM-RESTRICT
U$2 = SparkFun:KURRO_FOOTPRINT

## Net classes
0 default: width 0.203 mm, drill 0.29 mm, clearance 0.203 mm
1 ic: width 0.203 mm, drill 0.29 mm, clearance 0.203 mm
2 power: width 0.381 mm, drill 0.29 mm, clearance 0.635 mm